# EAGLE design snowman-r1 (EAGLE 5.12)
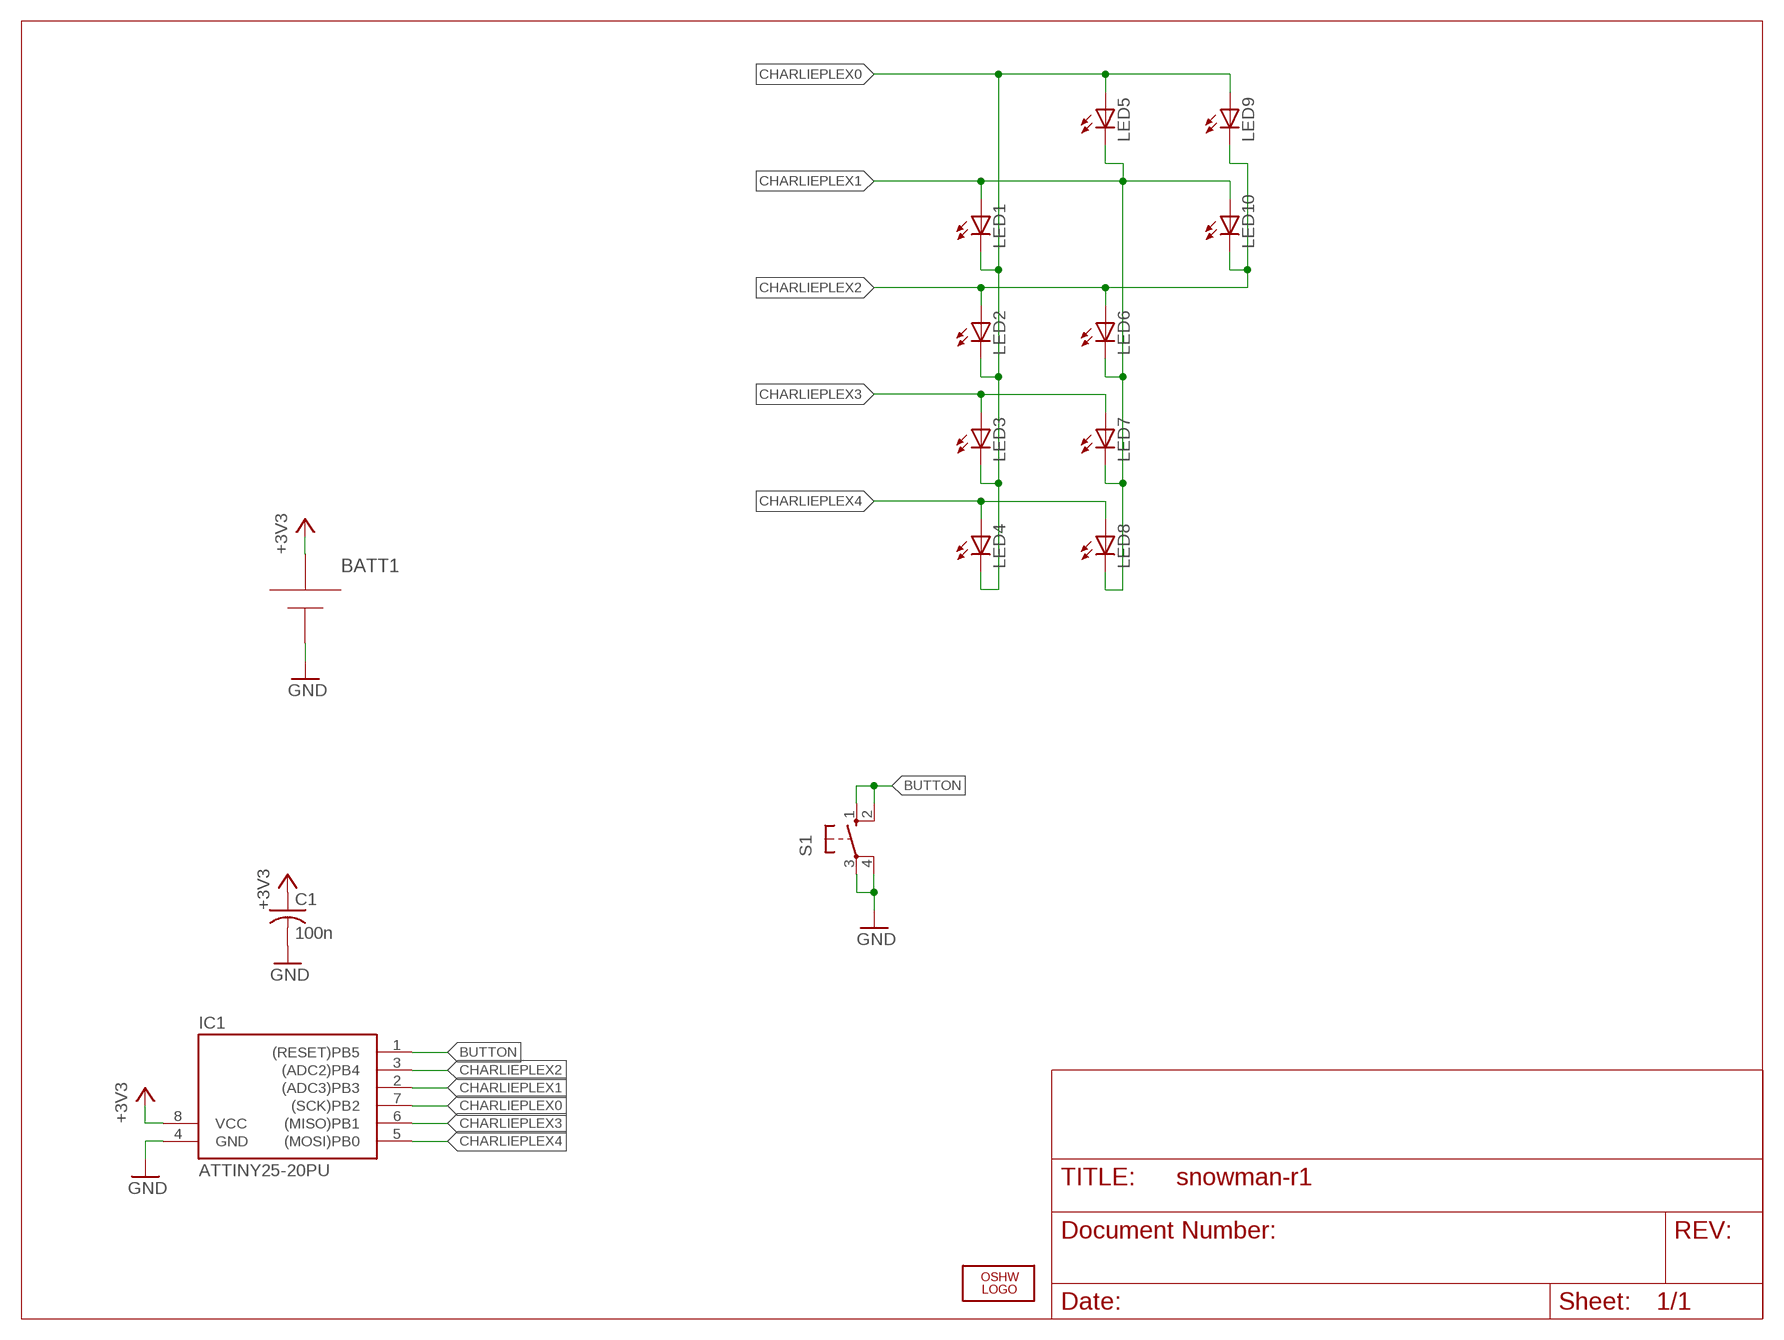
[diagram p0: schematic, sheet 1]

## Parts
BATT1  BC2AAAPC-CHINA  [BC2AAAPC-CHINA]
C1  100n  C-US050-025X075  [C050-025X075]
IC1  ATTINY25-20PU  TINY138P3  [DIL08]
LED1  LED3MM  [LED3MM]
LED2  LED3MM  [LED3MM]
LED3  LED3MM  [LED3MM]
LED4  LED3MM  [LED3MM]
LED5  LED3MM  [LED3MM]
LED6  LED3MM  [LED3MM]
LED7  LED3MM  [LED3MM]
LED8  LED3MM  [LED3MM]
LED9  LED3MM  [LED3MM]
LED10  LED3MM  [LED3MM]
LOGO1  OSHW_LOGO_FILLX0100-NT  [OSHW_FILLX100_NOTEXT]
S1  10-XX  [B3F-10XX]

## Nets
+3V3: BATT1.+ C1.1 IC1.8(VCC)
BUTTON: IC1.1((RESET)PB5) S1.1(S) S1.2(S1)
CHARLIEPLEX0: IC1.7((SCK)PB2) LED1.K(C) LED2.K(C) LED3.K(C) LED4.K(C) LED5.A LED9.A
CHARLIEPLEX1: IC1.2((ADC3)PB3) LED1.A LED5.K(C) LED6.K(C) LED7.K(C) LED8.K(C) LED10.A
CHARLIEPLEX2: IC1.3((ADC2)PB4) LED2.A LED6.A LED9.K(C) LED10.K(C)
CHARLIEPLEX3: IC1.6((MISO)PB1) LED3.A LED7.A
CHARLIEPLEX4: IC1.5((MOSI)PB0) LED4.A LED8.A
GND: BATT1.- C1.2 IC1.4(GND) S1.3(P) S1.4(P1)

## Library data of the parts
BATT1 = rbg-mpd-battholder:BC2AAAPC-CHINA
C1 = rcl:C-US: CAPACITOR, American symbol
IC1 = avr-5:TINY13*
LED1-LED10 = led:LED: LED OSRAM: - CHIPLED LG R971, LG N971, LY N971, LG Q971, LY Q971, LO R971, LY R971 LH N974, LH R974 LS Q976, LO Q976, LY Q976 LO Q996 - Hyper CHIPLED LW Q18S LB Q993, LB Q99A, LB R99A - SideLED LS A670, LO A670, LY A670, LG A670, LP A670 LB A673, LV A673, LT A673, LW A673 LH A674 LY A675 LS A676, LA A676, LO A676, LY A676, LW A676 LS A679, LY A679, LG A679 - Hyper Micro SIDELED® LS Y876, LA Y876, LO Y876, LY Y876 LT Y87S - SmartLED LW L88C, LW L88S LB L89C, LB L89S, LG L890 LS L89K, LO L89K, LY L89K LS L896, LA L896, LO L896, LY L896 - TOPLED LS T670, LO T670, LY T670, LG T670, LP T670 LSG T670, LSP T670, LSY T670, LOP T670, LYG T670 LG T671, LOG T671, LSG T671 LB T673, LV T673, LT T673, LW T673 LH T674 LS T676, LA T676, LO T676, LY T676, LB T676, LH T676, LSB T676, LW T676 LB T67C, LV T67C, LT T67C, LS T67K, LO T67K, LY T67K, LW E67C LS E67B, LA E67B, LO E67B, LY E67B, LB E67C, LV E67C, LT E67C LW T67C LS T679, LY T679, LG T679 LS T770, LO T770, LY T770, LG T770, LP T770 LB T773, LV T773, LT T773, LW T773 LH T774 LS E675, LA E675, LY E675, LS T675 LS T776, LA T776, LO T776, LY T776, LB T776 LHGB T686 LT T68C, LB T68C - Hyper Mini TOPLED® LB M676 - Mini TOPLED Santana® LG M470 LS M47K, LO M47K, LY M47K Source: http://www.osram.convergy.de LUXEON: - LUMILED® LXK2-PW12-R00, LXK2-PW12-S00, LXK2-PW14-U00, LXK2-PW14-V00 LXK2-PM12-R00, LXK2-PM12-S00, LXK2-PM14-U00 LXK2-PE12-Q00, LXK2-PE12-R00, LXK2-PE12-S00, LXK2-PE14-T00, LXK2-PE14-U00 LXK2-PB12-K00, LXK2-PB12-L00, LXK2-PB12-M00, LXK2-PB14-N00, LXK2-PB14-P00, LXK2-PB14-Q00 LXK2-PR12-L00, LXK2-PR12-M00, LXK2-PR14-Q00, LXK2-PR14-R00 LXK2-PD12-Q00, LXK2-PD12-R00, LXK2-PD12-S00 LXK2-PH12-R00, LXK2-PH12-S00 LXK2-PL12-P00, LXK2-PL12-Q00, LXK2-PL12-R00 Source: www.luxeon.com KINGBRIGHT: KA-3528ASYC Source: www.kingbright.com
LOGO1 = ohw-logo:OSHW_LOGO_FILL
S1 = rbg-generic-tact-switch:10-XX: OMRON SWITCH

## Board
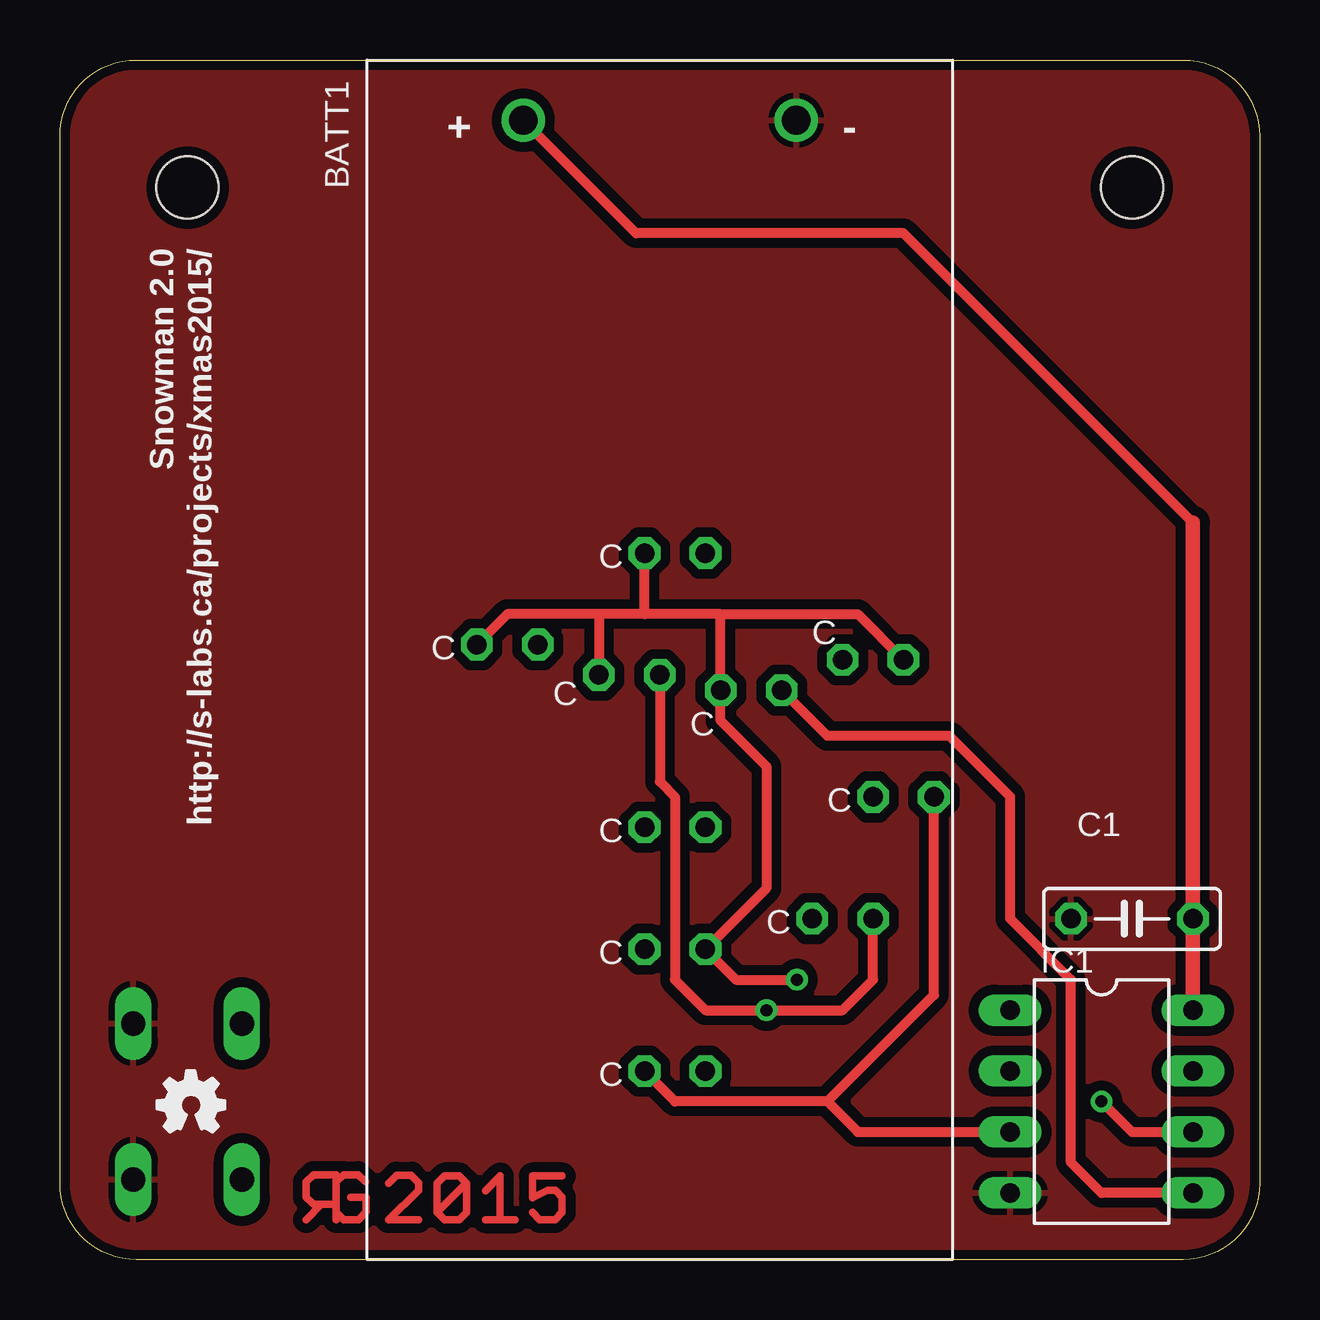
[diagram p1: board, top side]
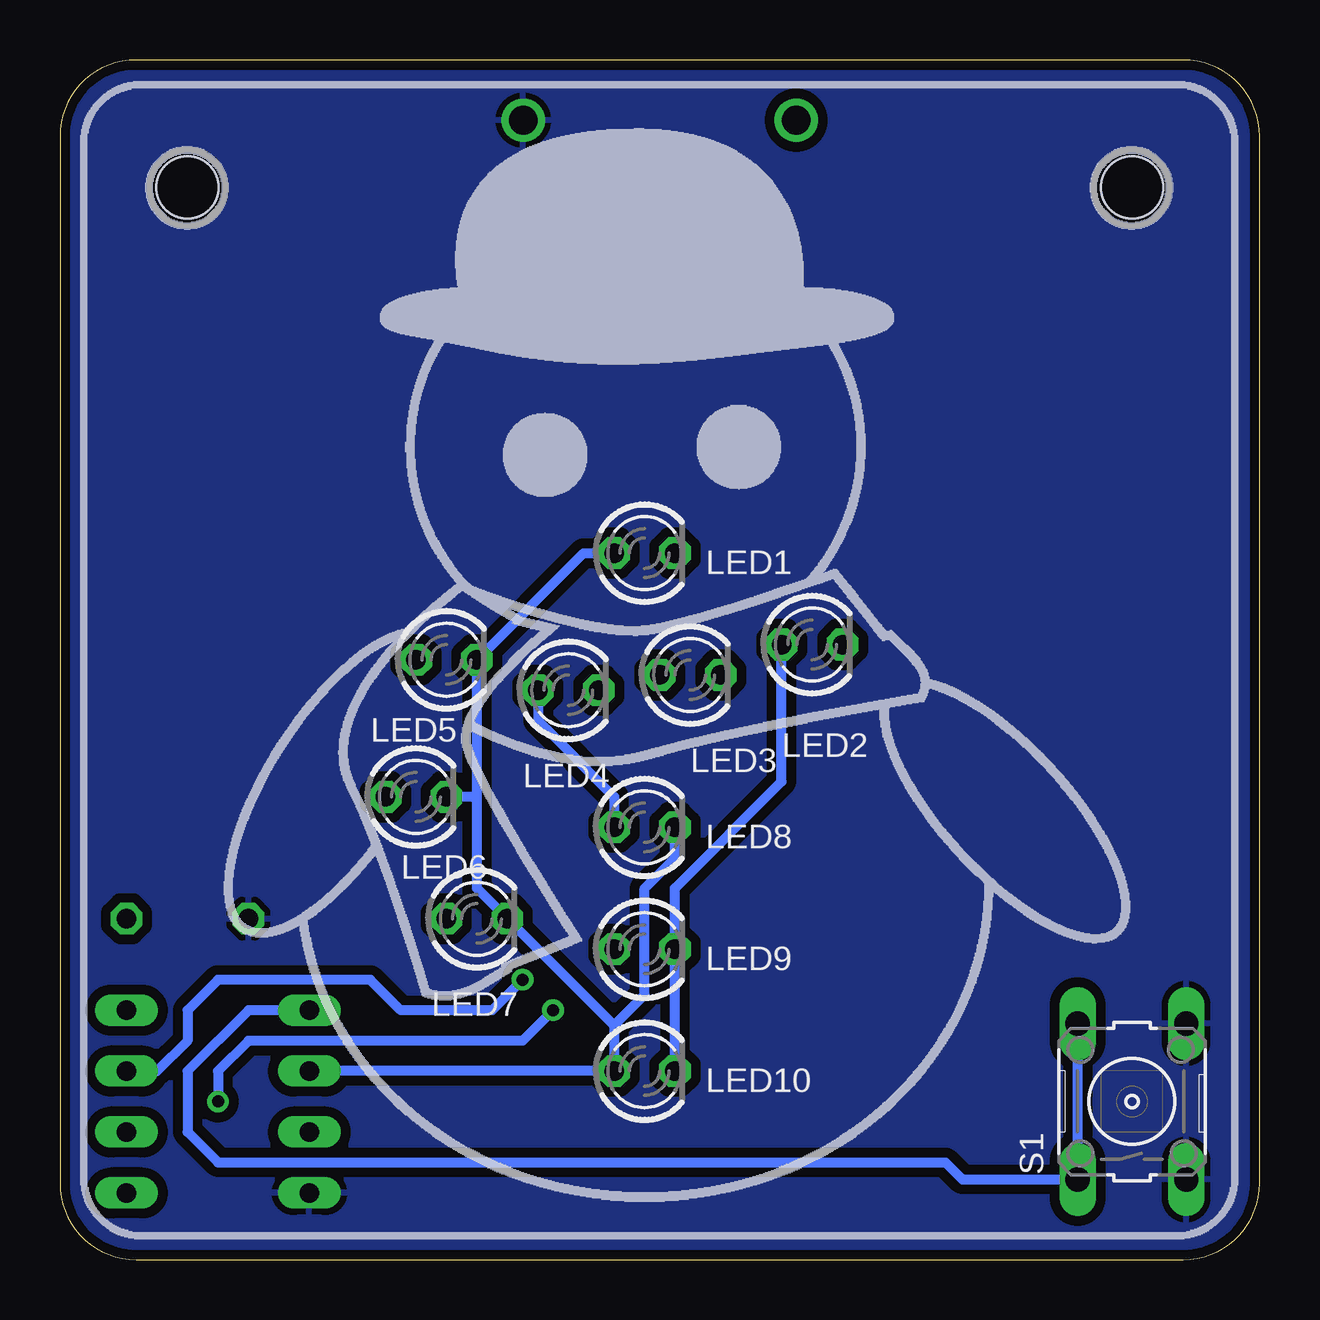
[diagram p2: board, bottom side, seen from below]

Size 50 x 50 mm. Coordinates in mm from the lower left corner, seen from the top.
Outline: 46.83,50 arc-90 50,46.83 50,3.18 arc-90 46.83,0 3.18,0 arc-90 0,3.18 0,46.83 arc-90 3.18,50 46.83,50
Copper layers (1*16): Top 0.035mm / dielectric 1.5mm / Bottom 0.035mm
Design rules "default *": minimum track width 10mil, minimum drill 0.5mm, track to track 11mil, track to pad 11mil, pad to pad 11mil, via to via 11mil, smd to smd 11mil, copper to edge 10mil, drill to drill 8mil, minimum pad ring 10mil, minimum via ring 8mil, stop-mask expansion 4mil, vias tented up to drill 20mil, thermal gap 10mil
Holes 2.6 mm at 44.69,44.69 5.32,44.69

### Footprints (pad centres in the part's own frame; a part is rotated, then mirrored left to right if it is on the bottom)
BC2AAAPC-CHINA = drill 1.2 round: + -22.49,-5.69; - -22.49,5.69
C050-025X075 = drill 0.813 octagon: 1 -2.54,0; 2 2.54,0
DIL08 = drill 0.813 long: 1 -3.81,-3.81; 2 -1.27,-3.81; 3 1.27,-3.81; 4 3.81,-3.81; 5 3.81,3.81; 6 1.27,3.81; 7 -1.27,3.81; 8 -3.81,3.81
LED3MM = drill 0.813 octagon: A -1.27,0; K 1.27,0
B3F-10XX = drill 1.016 long: 1 -3.251,2.261; 2 3.251,2.261; 3 -3.251,-2.261; 4 3.251,-2.261

### Placement (x,y rotation side)
BATT1  25,25 270 top
C1  44.69,14.21 180 top
IC1  43.41,6.59 270 top
LED1  25.64,29.45 0 bottom
LED2  18.65,25.64 0 bottom
LED3  23.73,24.36 0 bottom
LED4  28.81,23.73 0 bottom
LED5  33.89,25 0 bottom
LED6  35.16,19.29 0 bottom
LED7  32.62,14.21 0 bottom
LED8  25.64,18.02 0 bottom
LED9  25.64,12.94 0 bottom
LED10  25.64,7.86 0 bottom
LOGO1  4.05,5.32 0 top
S1  5.32,6.59 90 bottom
U$1  [SNOWMAN]  49.13,0.87 0 bottom
U$3  [RGLOGO_SMALL_2015]  11.66,1.5 0 top

### Tracks (layer width: path | path; a pad name or v marks a point on that pad's centre or on a via)
+3V3
  Top 0.406: 47.23,30.71 35.16,42.78 24.02,42.78 BATT1.+
  Top 0.61: 47.23,30.71 C1.1 IC1.8
BUTTON
  Bottom 0.406: S1.2 S1.1 12.38,3.33 13.09,4.05 43.41,4.05 44.69,5.32 44.69,7.86 42.14,10.39 IC1.1
CHARLIEPLEX0  (via drill 0.5)
  Top 0.406: LED5.A 33.26,26.91 27.54,26.91 | 27.54,26.91 24.36,26.91 | 24.36,26.91 22.46,26.91 | 22.46,26.91 18.65,26.91 LED2.K | 24.36,26.91 LED1.K | 22.46,26.91 LED3.K | 27.54,26.91 LED4.K 27.54,22.46 29.45,20.55 29.45,15.47 LED9.A 28.18,11.66 v30.71,11.66
  Bottom 0.406: v30.71,11.66 31.98,10.39 35.8,10.39 37.06,11.66 43.41,11.66 44.69,10.39 44.69,9.12 45.95,7.86 IC1.7
CHARLIEPLEX1
  Bottom 0.406: LED1.A 28.18,29.45 LED5.K 32.62,19.29 | 32.62,19.29 32.62,15.47 LED7.K 26.91,9.76 | 32.62,19.29 LED6.K | 26.91,9.76 LED10.A IC1.2 | LED8.K 24.36,16.74 25.64,15.47 25.64,11.03 26.91,9.76
CHARLIEPLEX2
  Top 0.406: LED6.A 36.43,11.03 31.98,6.59 | 31.98,6.59 25.64,6.59 LED10.K | IC1.3 33.26,5.32 31.98,6.59
  Bottom 0.406: LED2.A 19.92,19.92 24.36,15.47 LED9.K LED10.K
CHARLIEPLEX3  (via drill 0.5)
  Top 0.406: LED3.A 25,19.92 25.64,19.29 25.64,11.66 26.91,10.39 v29.45,10.39 32.62,10.39 33.89,11.66 LED7.A | IC1.6 44.69,5.32 v43.41,6.59
  Bottom 0.406: v43.41,6.59 43.41,7.86 42.14,9.12 30.71,9.12 v29.45,10.39
CHARLIEPLEX4
  Top 0.406: IC1.5 43.41,2.77 42.14,4.05 42.14,11.66 39.61,14.21 39.61,19.29 37.06,21.82 31.98,21.82 LED4.A
  Bottom 0.406: LED4.A 30.08,22.46 26.91,19.29 LED8.A
GND
  pour Bottom (isolate 0.406): 51.03,51.03 -1.04,51.03 -1.04,-1.04 51.03,-1.04
  pour Top (isolate 0.406): 51.03,51.03 -1.04,51.03 -1.04,-1.04 51.03,-1.04

### Text on the board
tPlace: Snowman 2.0 | http://s-labs.ca/projects/xmas2015/
tNames: C | C | C | C | C | C | C | C | C | C